# EAGLE design smarty04 (EAGLE 6.5.0)
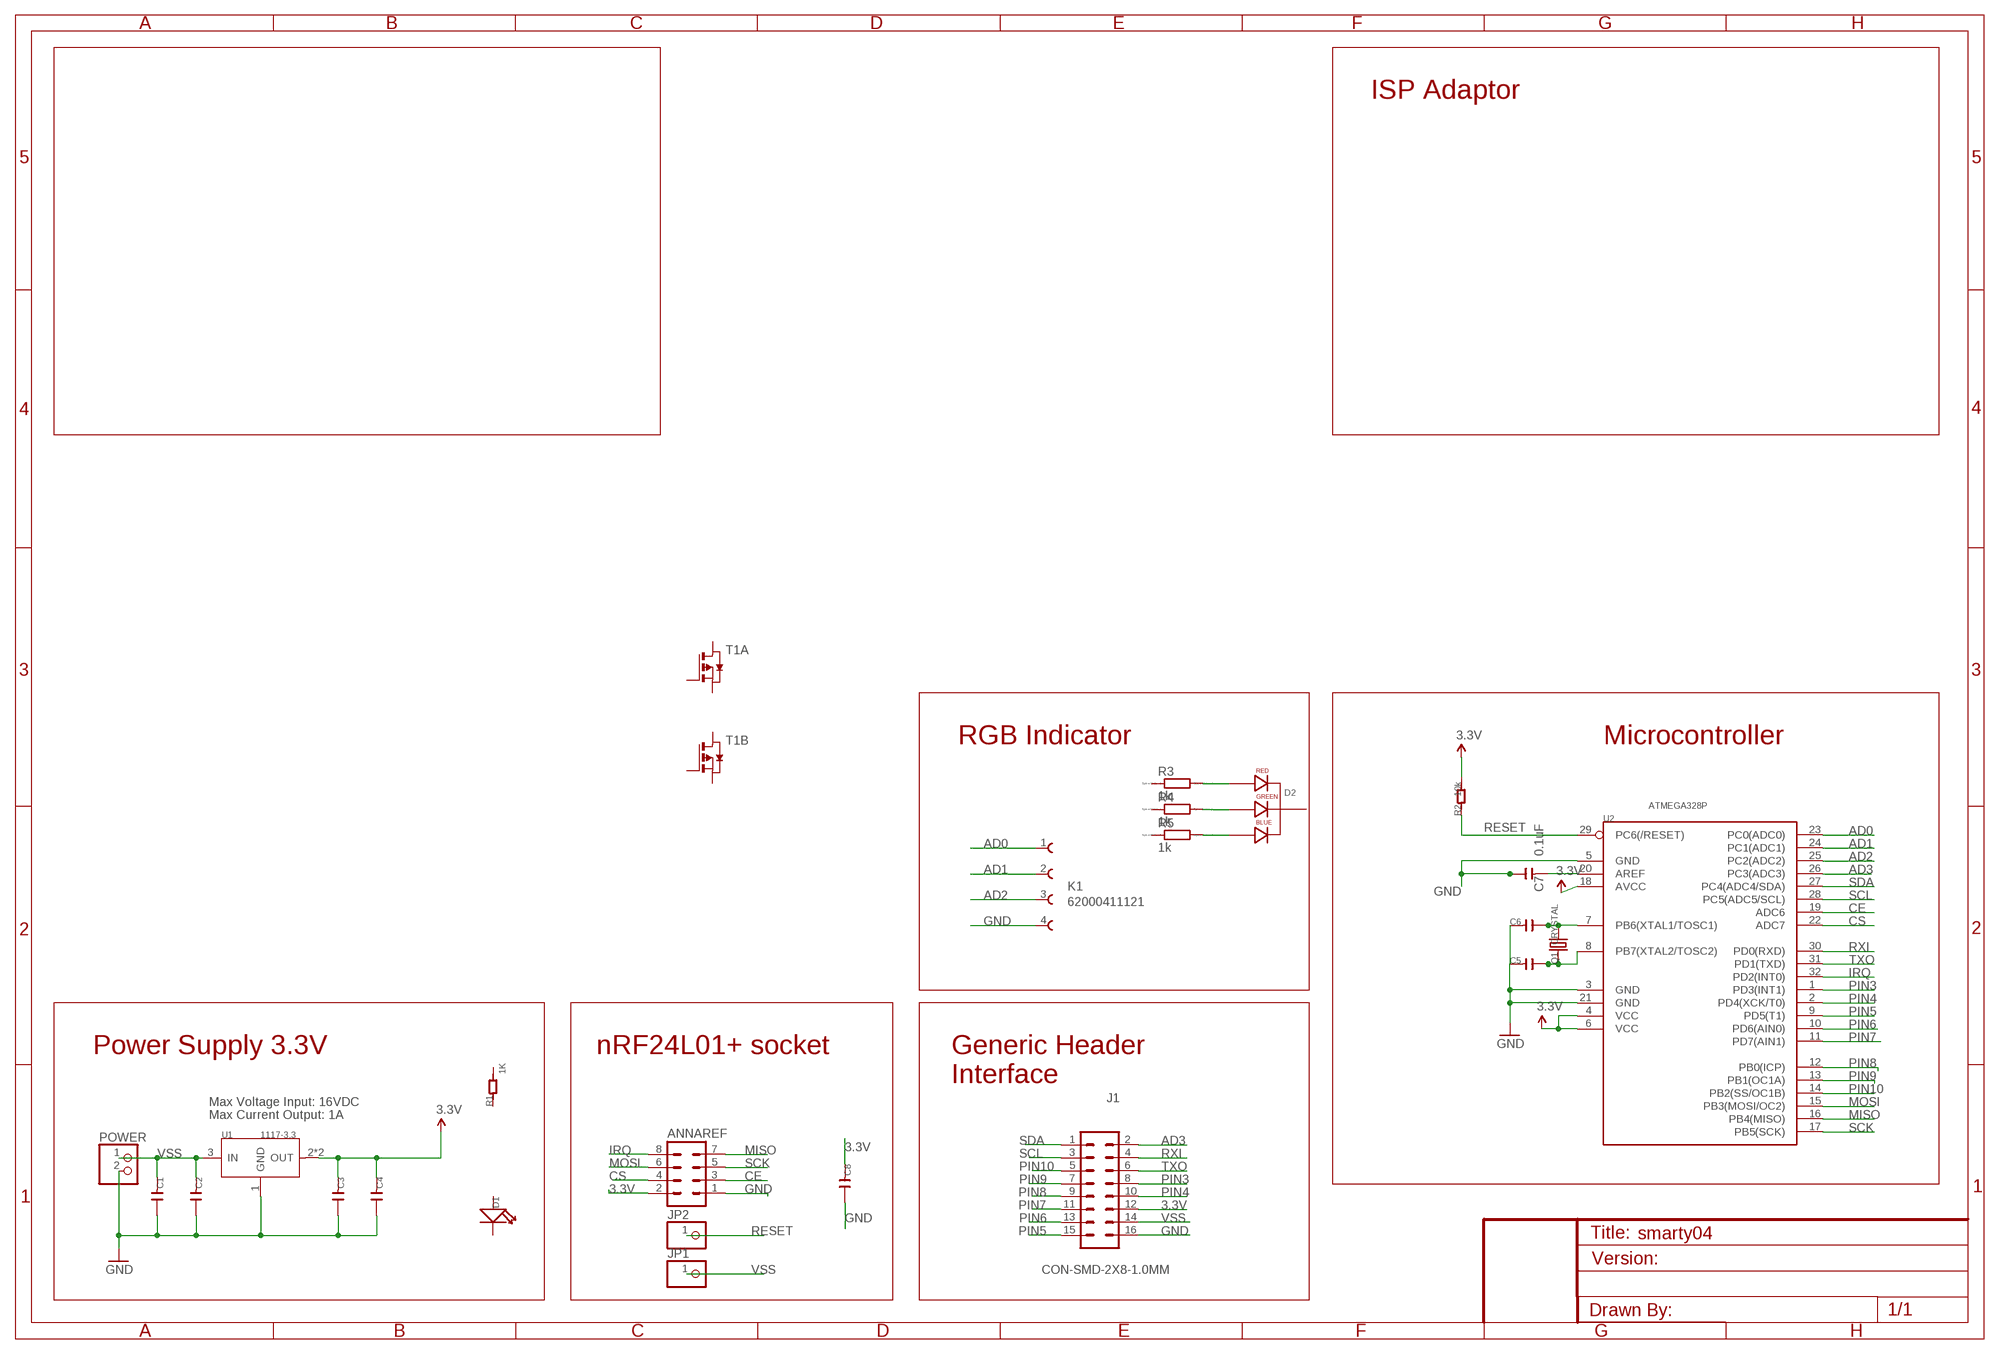
[diagram p0: schematic, sheet 1]

## Parts
ANNAREF  MA04-2  [MA04-2]
C1  C-0603  [C0603]
C2  C-0805  [C0805]
C3  C-0603  [C0603]
C4  C-0805  [C0805]
C5  C-0603  [C0603]
C6  C-0603  [C0603]
C7  0.1uF  C-0805  [C0805]
C8  C-0805  [C0805]
D1  LED  [LED0603]
D2  LED-RGB-CC-THRUCLEAR  [LED-RGB-THRU]
J1  CON-SMD-2X8-1.0MM  [SBH100-NBPC-D08]
JP1  PINHD-1X1  [1X01]
JP2  PINHD-1X1  [1X01]
K1  62000411121  [62000411121]
POWER  PINHD-1X2  [1X02]
Q1  CRYSTAL  CRYSTAL-0500290P1  [2P-SMD-5.0X3.2]
R1  1K  R-0603  [R0603]
R2  10k  R-0603  [R0603]
R3  1k  RR0603  [R0603]
R4  1k  RR0603  [R0603]
R5  1k  RR0603  [R0603]
T1  PMOS2SO8  [SO8]
U1  1117-3.3  CJ1117-3.3-1310120P1  [SOT89]
U2  ATMEGA328P  ATMEGA328P-AU-1030060P1  [TQFP32]

## Nets
3.3V [power]: ANNAREF.2 C3.1 C4.1 C8.1 J1.12 R2.2 U1.2(OUT) U1.4(OUT) U2.4(VCC) U2.6(VCC) U2.18(AVCC)
AD0: K1.1 U2.23(PC0(ADC0))
AD1: K1.2 U2.24(PC1(ADC1))
AD2: K1.3 U2.25(PC2(ADC2))
AD3: J1.2 U2.26(PC3(ADC3))
CE: ANNAREF.3 U2.19(ADC6)
CS: ANNAREF.4 U2.22(ADC7)
GND [power]: ANNAREF.1 C1.2 C2.2 C3.2 C4.2 C5.1 C6.1 C7.2 C8.2 J1.16 K1.4 POWER.2 U1.1(GND) U2.3(GND) U2.5(GND) U2.21(GND)
IRQ: ANNAREF.8 U2.32(PD2(INT0))
MISO: ANNAREF.7 U2.16(PB4(MISO))
MOSI: ANNAREF.6 U2.15(PB3(MOSI/OC2))
N$1: C7.1 U2.20(AREF)
N$2: C6.2 Q1.2 U2.7(PB6(XTAL1/TOSC1))
N$3: D2.1(RED_CATHODE) R3.2
N$4: C5.2 Q1.1 U2.8(PB7(XTAL2/TOSC2))
N$6: D2.3(GREEN_CATHODE) R4.2
N$7: D2.4(BLUE_CATHODE) R5.2
PIN3: J1.8 U2.1(PD3(INT1))
PIN4: J1.10 U2.2(PD4(XCK/T0))
PIN5: J1.15 U2.9(PD5(T1))
PIN6: J1.13 U2.10(PD6(AIN0))
PIN7: J1.11 U2.11(PD7(AIN1))
PIN8: J1.9 U2.12(PB0(ICP))
PIN9: J1.7 U2.13(PB1(OC1A))
PIN10: J1.5 U2.14(PB2(SS/OC1B))
RESET: JP2.1 R2.1 U2.29(PC6(/RESET))
RXI: J1.4 U2.30(PD0(RXD))
SCK: ANNAREF.5 U2.17(PB5(SCK))
SCL: J1.3 U2.28(PC5(ADC5/SCL))
SDA: J1.1 U2.27(PC4(ADC4/SDA))
TXO: J1.6 U2.31(PD1(TXD))
VSS [power]: C1.1 C2.1 J1.14 JP1.1 POWER.1 U1.3(IN)
Unconnected: D1.+ D1.- D2.2(CATHODE) R1.1 R1.2 R3.1 R4.1 R5.1 T1.1(A:S) T1.2(A:G) T1.3(B:S) T1.4(B:G) T1.5(B:D) T1.6(B:D) T1.7(A:D) T1.8(A:D)

## Notes on the sheet
- ISP Adaptor
- RGB Indicator | Microcontroller
- Power Supply 3.3V | nRF24L01+ socket
- Generic Header
  Interface
- Max Voltage Input: 16VDC
- Max Current Output: 1A

## Library data of the parts
ANNAREF = con-lstb:MA04-2: PIN HEADER; OC_FARNELL: unknown; OC_NEWARK: unknown
C1-C8 = OPL:C*
D1 = OPL:LED*: LED
D2 = SparkFun-LED:LED-RGB-CC-THRU: RGB Through-hole common cathode LED SparkFun Storefront: COM-00105 (Clear) COM-09264 (Diffuse); PROD_ID: DIO-08418
J1 = con-1.0mm:CON-SMD-2X8-1.0MM: HEADER - Vertical, Shrouded
JP1 JP2 = pinhead:PINHD-1X1: PIN HEADER
K1 = Wuerth_Elektronik_eiCan_01_Pin__Socked_Headers_v1_3:62000411121: WR-PHD 2.00mm Pin Header, 4 Pins
POWER = pinhead:PINHD-1X2: PIN HEADER
Q1 = OPL:CRYSTAL*
R1 R2 = OPL:R*
R3-R5 = eagle-ltspice:R: RESISTOR, European symbol; SPICEMODEL: NONE; SPICEPREFIX: R
T1 = zetex:PMOS2: DUAL 30V P-CHANNEL ENHANCEMENT MODE MOSFET Source: Data sheet <http://www.diodes.com/datasheets/ZXMP3A16DN8.pdf> SOP8 Source: Data sheet <http://www.diodes.com/datasheets/ZXMD63P03X.pdf> MSOP8; OC_FARNELL: unknown; OC_NEWARK: unknown
U1 = OPL:CJ1117-3.3: 1A Low Dropout Linear Regulator
U2 = OPL:ATMEGA328P-AU: 8-bit AVR Microcontroller with 32K Bytes In-System Programmable Flash

## Net classes
0 default: width 0.203 mm, drill 0.203 mm, clearance 0.305 mm
1 power: width 0.254 mm, drill 0.406 mm, clearance 0.305 mm

## Board
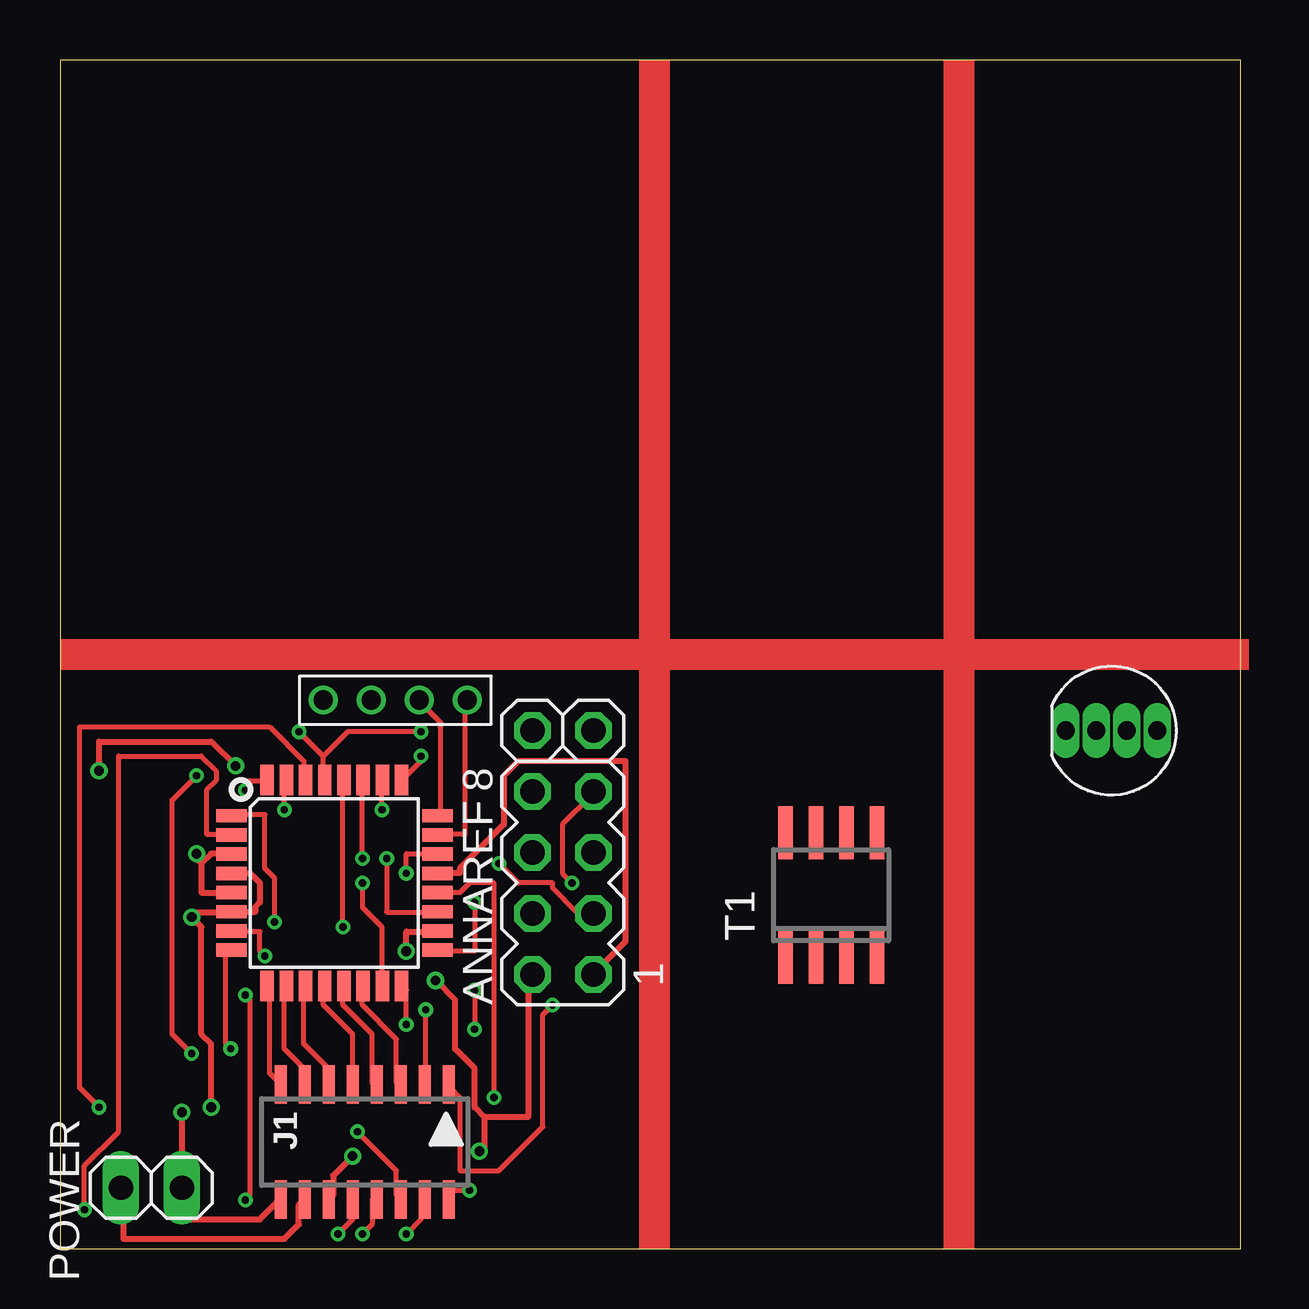
[diagram p1: board, top side]
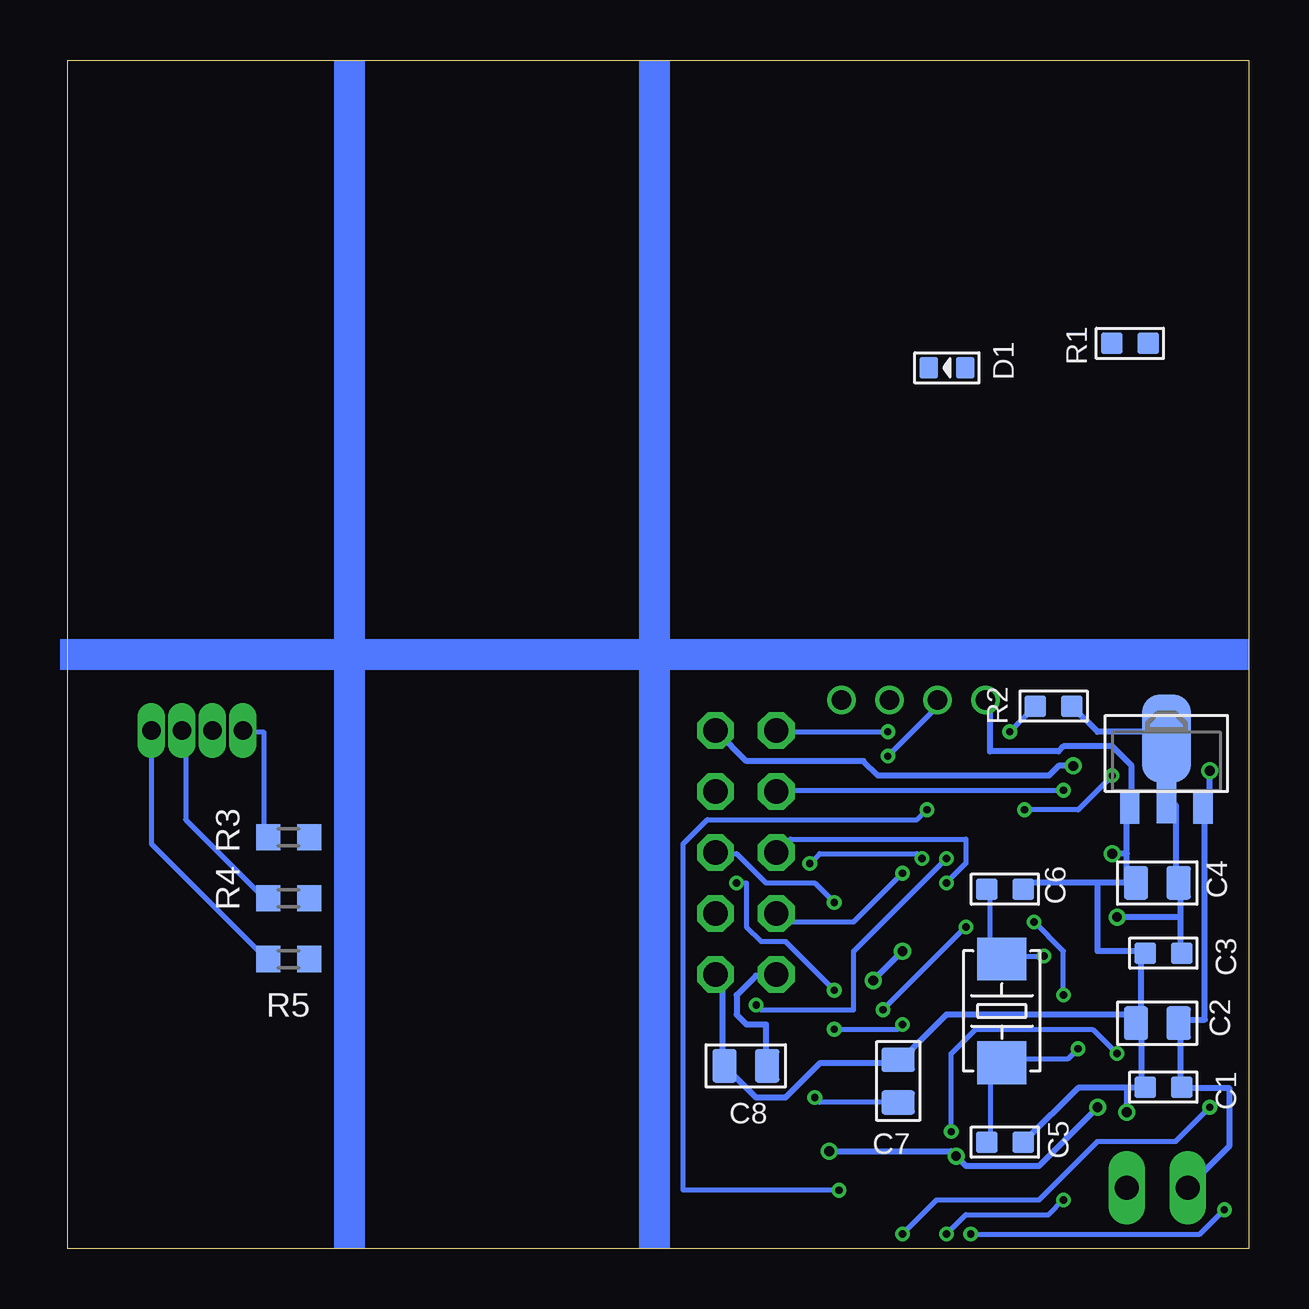
[diagram p2: board, bottom side, seen from below]

Size 49.2 x 49.52 mm. Coordinates in mm from the lower left corner, seen from the top.
Outline: 0,0 49.2,0 49.2,49.52 0,49.52 0,0
Copper layers (1*2*15*16): Top 0.035mm / dielectric 0.2mm / layer 2 0.0175mm / dielectric 1.1mm / layer 15 0.0175mm / dielectric 0.2mm / Bottom 0.035mm
Design rules "SeeedStudio_DRU_no_angle_20130527": minimum track width 6mil, minimum drill 12mil, track to track 6mil, track to pad 6mil, pad to pad 6mil, via to via 6mil, smd to smd 0mil, copper to edge 10mil, drill to drill 10mil, minimum pad ring 6mil, minimum via ring 6mil, stop-mask expansion 2mil, vias tented up to drill 25mil, thermal gap 10mil

### Footprints (pad centres in the part's own frame; a part is rotated, then mirrored left to right if it is on the bottom)
MA04-2 = drill 1.016 octagon: 1 -3.81,-1.27; 2 -3.81,1.27; 3 -1.27,-1.27; 4 -1.27,1.27; 5 1.27,-1.27; 6 1.27,1.27; 7 3.81,-1.27; 8 3.81,1.27
C0603 = smd 0.889 x 0.889: 1 -0.762,0; 2 0.762,0
C0805 = smd 1.016 x 1.397: 1 -0.889,0; 2 0.889,0
LED0603 = smd 0.762 x 0.889: + -0.762,0; - 0.762,0
LED-RGB-THRU = drill 0.762 pad 0.889 long: 1 1.905,0; 2 0.635,0; 3 -0.635,0; 4 -1.905,0
SBH100-NBPC-D08 = smd 0.5 x 1.6: 1 -3.5,-2.4; 2 -3.5,2.4; 3 -2.5,-2.4; 4 -2.5,2.4; 5 -1.5,-2.4; 6 -1.5,2.4; 7 -0.5,-2.4; 8 -0.5,2.4; 9 0.5,-2.4; 10 0.5,2.4; 11 1.5,-2.4; 12 1.5,2.4; 13 2.5,-2.4; 14 2.5,2.4; 15 3.5,-2.4; 16 3.5,2.4
1X01 = drill 1.016 octagon: 1 0,0
62000411121 = drill 0.8: 1 -3,0; 2 -1,0; 3 1,0; 4 3,0
1X02 = drill 1.016 long: 1 -1.27,0; 2 1.27,0
2P-SMD-5.0X3.2 = smd 1.778 x 2.032: 1 -2.159,0; 2 2.159,0
R0603 = smd 0.889 x 0.889: 1 -0.762,0; 2 0.762,0
R0603' = smd 1 x 1.1: 1 -0.85,0; 2 0.85,0
SO8 = smd 0.6 x 2.2: 1 -1.905,-2.6; 2 -0.635,-2.6; 3 0.635,-2.6; 4 1.905,-2.6; 5 1.905,2.6; 6 0.635,2.6; 7 -0.635,2.6; 8 -1.905,2.6
SOT89 = smd 0.8 x 1.4: 1 -1.524,-1.905; 3 1.524,-1.905 | smd 0.8 x 1.9: 2 0,-1.651 | smd 2.032 x 3.65: 4 0,0.94
TQFP32 = smd 1.27 x 0.559: 1 -4.293,2.8; 2 -4.293,2; 3 -4.293,1.2; 4 -4.293,0.4; 5 -4.293,-0.4; 6 -4.293,-1.2; 7 -4.293,-2; 8 -4.293,-2.8; 17 4.293,-2.8; 18 4.293,-2; 19 4.293,-1.2; 20 4.293,-0.4; 21 4.293,0.4; 22 4.293,1.2; 23 4.293,2; 24 4.293,2.8 | smd 0.559 x 1.27: 9 -2.8,-4.293; 10 -2,-4.293; 11 -1.2,-4.293; 12 -0.4,-4.293; 13 0.4,-4.293; 14 1.2,-4.293; 15 2,-4.293; 16 2.8,-4.293; 25 2.8,4.293; 26 2,4.293; 27 1.2,4.293; 28 0.4,4.293; 29 -0.4,4.293; 30 -1.2,4.293; 31 -2,4.293; 32 -2.8,4.293

### Placement (x,y rotation side)
ANNAREF  20.95,15.24 90 top
C1  3.56,6.73 180 bottom
C2  3.81,9.4 180 bottom
C3  3.56,12.32 180 bottom
C4  3.81,15.24 180 bottom
C5  10.16,4.45 180 bottom
C6  10.16,14.99 180 bottom
C7  14.61,6.99 90 bottom
C8  20.95,7.62 180 bottom
D1  12.57,36.7 180 bottom
D2  43.81,21.59 180 top
J1  12.7,4.45 180 top
JP1  22.23,21.59 0 top
JP2  19.68,21.59 0 top
K1  13.97,22.86 180 top
POWER  3.81,2.54 0 top
Q1  10.29,9.91 90 bottom
R1  4.95,37.72 0 bottom
R2  8.13,22.61 0 bottom
R3  1k  [R0603']  40.01,17.14 180 bottom
R4  1k  [R0603']  40.01,14.61 180 bottom
R5  1k  [R0603']  40.01,12.06 180 bottom
T1  32.13,14.73 0 top
U1  3.43,20.32 0 bottom
U2  11.43,15.24 0 top

### Tracks (layer width: path | path; a pad name or v marks a point on that pad's centre or on a via)
3.3V  (via drill 0.41)
  Top 0.254: U2.4 7.32,15.65 7.92,15.65 8.33,15.24 8.33,14.43 8.13,14.22 8.13,14.02 7.32,14.02 U2.6 7.11,14.02 5.49,14.02 v5.49,13.82 5.89,13.41 5.89,8.94 6.3,8.53 v6.3,5.89 | v14.43,12.39 14.43,13.21 15.65,13.21 U2.18 | v15.65,11.18 16.46,10.36 16.46,8.33 17.27,7.52 17.27,5.89 17.68,5.49 | 17.68,5.49 19.51,5.49 19.51,11.38 ANNAREF.2 | v12.19,3.86 11.38,3.05 11.38,2.23 J1.12 | v17.48,4.06 17.68,4.27 17.68,5.49
  Bottom 0.254: 2.85,13.82 2.85,15.24 C4.1 3.05,15.24 3.05,18.49 3.25,18.49 U1.2 3.45,18.69 3.45,21.13 U1.4 3.45,21.34 3.66,21.54 6.3,21.54 R2.2 | 2.85,13.82 2.85,12.39 C3.1 | 2.85,13.82 v5.49,13.82 | v15.65,11.18 v14.43,12.39 | C8.1 20.12,7.72 20.12,9.35 20.93,9.35 21.34,9.75 21.34,10.57 20.52,11.38 19.71,11.38 ANNAREF.2 | v17.48,4.06 12.39,4.06 v12.19,3.86 11.79,3.45 8.74,3.45 v6.3,5.89
AD0
  Top 0.203: U2.23 15.85,17.27 16.87,17.27 16.87,22.76 K1.1
AD1
  Top 0.203: U2.24 15.85,18.09 15.85,21.95 15.04,22.76 K1.2
AD2  (via drill 0.3)
  Top 0.203: v15.04,20.52 15.04,20.32 14.43,19.71 U2.25
  Bottom 0.203: v15.04,20.52 12.8,22.76 K1.3
AD3  (via drill 0.3)
  Top 0.203: v13.41,18.29 13.41,19.51 U2.26 | v17.07,2.44 16.26,2.44 16.26,2.23 J1.2
  Bottom 0.203: v13.41,18.29 13.82,17.88 22.55,17.88 23.57,16.87 23.57,2.44 v17.07,2.44
CE  (via drill 0.3)
  Top 0.203: v13.61,16.26 13.61,14.02 15.65,14.02 U2.19 | v18.29,16.05 19.1,15.24 20.52,15.24 20.52,15.04 21.54,14.02 22.15,14.02 ANNAREF.3
  Bottom 0.203: v13.61,16.26 13.82,16.46 17.88,16.46 v18.29,16.05
CS  (via drill 0.3)
  Top 0.203: v14.43,15.65 14.43,16.46 15.65,16.46 U2.22
  Bottom 0.203: v14.43,15.65 16.46,13.61 19.3,13.61 19.51,13.82 ANNAREF.4
GND  (via drill 0.41)
  Top 0.254: U2.21 15.85,15.65 16.66,15.65 16.66,15.85 18.49,17.68 18.49,19.71 19.1,20.32 23.57,20.32 23.57,12.8 22.35,11.58 ANNAREF.1 | 5.89,16.05 5.89,14.83 7.11,14.83 U2.5 | 5.89,16.05 6.3,16.46 7.11,16.46 U2.3 | 5.89,16.05 5.69,16.26 v5.69,16.46 | J1.16 9.14,2.03 8.33,1.22 5.08,1.22 POWER.2 v5.08,5.69
  Bottom 0.254: ANNAREF.1 22.15,11.38 21.95,11.38 21.95,7.72 C8.2 20.52,6.3 19.3,6.3 17.88,7.72 14.63,7.72 C7.2 14.43,7.92 12.6,9.75 4.47,9.75 | C6.1 9.14,15.24 6.3,15.24 | 5.08,15.24 6.3,15.24 | 5.08,15.24 5.08,16.46 | 5.08,16.46 5.08,18.29 U1.1 4.88,18.49 4.88,20.12 5.69,20.93 7.72,20.93 7.92,20.73 10.77,20.73 10.77,22.76 K1.4 | 5.08,15.24 C4.2 | 5.08,16.46 v5.69,16.46 | C2.2 4.67,9.35 4.47,9.35 4.47,6.91 C1.2 4.47,6.71 5.08,6.71 | 4.47,9.75 4.47,9.55 4.67,9.55 C2.2 | 4.47,9.75 4.47,12.19 C3.2 4.47,12.39 6.3,12.39 6.3,15.24 | 5.08,6.71 7.11,6.71 9.35,4.47 C5.1 | 4.47,9.75 C2.2 | 5.08,6.71 v5.08,5.69
IRQ  (via drill 0.3)
  Top 0.203: v7.72,19.1 7.92,19.3 7.92,19.51 8.53,19.51 U2.32
  Bottom 0.203: v7.72,19.1 19.51,19.1 ANNAREF.8
MISO  (via drill 0.3)
  Top 0.203: v14.43,9.35 14.43,10.77 U2.16 | v17.27,10.77 v17.27,9.14 | v21.34,15.24 20.93,15.65 20.93,17.68 22.15,18.9 ANNAREF.7
  Bottom 0.203: v14.43,9.35 14.63,9.14 v17.27,9.14 | v17.27,10.77 19.3,12.8 20.32,12.8 20.93,13.41 20.93,15.24 v21.34,15.24
MOSI  (via drill 0.3)
  Top 0.203: v12.6,15.24 12.6,14.22 13.41,13.41 13.41,10.97 U2.15
  Bottom 0.203: v12.6,15.24 11.79,16.05 11.79,17.07 19.1,17.07 19.51,16.66 ANNAREF.6
N$1  (via drill 0.3)
  Top 0.203: v18.09,6.3 18.09,15.24 17.07,15.24 16.66,14.83 15.85,14.83 U2.20
  Bottom 0.203: v18.09,6.3 17.88,6.1 C7.1
N$2  (via drill 0.3)
  Top 0.203: v8.53,12.19 8.33,12.39 8.33,13.21 7.32,13.21 U2.7
  Bottom 0.203: 10.97,15.04 C6.2 10.77,14.83 10.77,12.19 10.36,12.19 Q1.2 10.16,12.19 v8.53,12.19
N$3
  Bottom 0.203: R3.2 41.05,17.27 41.05,21.54 41.86,21.54 D2.1
N$4  (via drill 0.3)
  Top 0.203: v7.11,8.33 6.91,8.53 6.91,12.19 7.11,12.39 U2.8
  Bottom 0.203: 10.97,4.47 C5.2 10.77,4.47 10.77,7.72 10.36,7.72 Q1.1 10.16,7.92 7.52,7.92 v7.11,8.33
N$6
  Bottom 0.203: R4.2 41.05,14.63 44.3,17.88 44.3,21.54 D2.3
N$7
  Bottom 0.203: D2.4 45.72,16.87 41.05,12.19 R5.2
PIN3  (via drill 0.3)
  Top 0.203: v8.94,13.61 8.94,15.44 8.53,15.85 8.53,18.09 7.32,18.09 U2.1 | v7.72,10.57 7.92,10.36 7.92,2.23 v7.72,2.03 | v12.6,0.61 13.01,1.02 13.01,2.03 J1.8
  Bottom 0.203: v8.94,13.61 7.72,12.39 v7.72,10.57 | v7.72,2.03 8.33,1.42 11.79,1.42 v12.6,0.61
PIN4  (via drill 0.3)
  Top 0.203: v1.02,1.63 1.02,3.45 2.44,4.88 2.44,20.52 5.89,20.52 6.5,19.91 6.5,19.51 6.1,19.1 6.1,17.27 7.11,17.27 U2.2 | v11.58,0.61 12.19,1.22 12.19,2.03 J1.10
  Bottom 0.203: v1.02,1.63 2.03,0.61 v11.58,0.61
PIN5
  Top 0.203: U2.9 8.74,10.77 8.74,7.32 9.14,6.91 J1.15
PIN6
  Top 0.203: U2.10 9.35,10.77 9.35,8.33 10.16,7.52 10.16,6.91 J1.13
PIN7
  Top 0.203: U2.11 10.16,10.77 10.16,8.53 11.18,7.52 11.18,6.91 J1.11
PIN8
  Top 0.203: U2.12 10.97,10.77 10.97,10.16 12.19,8.94 12.19,6.91 J1.9
PIN9
  Top 0.203: U2.13 11.79,10.77 11.79,10.16 13.01,8.94 13.01,6.91 J1.7
PIN10
  Top 0.203: U2.14 12.6,10.77 12.6,10.16 14.02,8.74 14.02,6.91 J1.5
RESET  (via drill 0.3)
  Top 0.203: 10.97,20.52 v9.96,21.54 | 10.97,20.52 10.97,19.71 U2.29 | 10.97,20.52 11.99,21.54 v15.04,21.54
  Bottom 0.203: v9.96,21.54 R2.1 | v15.04,21.54 19.51,21.54 JP2.1
RXI  (via drill 0.3)
  Top 0.203: v1.63,5.89 0.81,6.71 0.81,21.74 8.74,21.74 10.16,20.32 10.16,19.71 U2.30 | v14.43,0.61 15.04,1.22 15.04,2.03 J1.4
  Bottom 0.203: v1.63,5.89 3.05,4.47 6.3,4.47 8.74,2.03 13.01,2.03 v14.43,0.61
SCK  (via drill 0.3)
  Top 0.203: v17.27,14.43 17.27,12.39 15.85,12.39 U2.17
  Bottom 0.203: v17.27,14.43 18.09,15.24 20.12,15.24 21.34,16.46 22.15,16.46 ANNAREF.5
SCL  (via drill 0.3)
  Top 0.203: v11.79,13.41 11.79,19.51 U2.28 | v15.24,9.96 15.24,6.91 J1.3
  Bottom 0.203: v15.24,9.96 v11.79,13.41
SDA  (via drill 0.3)
  Top 0.203: v12.6,16.26 12.6,19.51 U2.27 | v20.52,10.16 20.12,9.75 20.12,5.08 18.29,3.25 16.66,3.25 16.66,6.3 16.26,6.71 J1.1
  Bottom 0.203: v12.6,16.26 16.46,12.39 16.46,9.96 20.32,9.96 v20.52,10.16
TXO  (via drill 0.3)
  Top 0.203: v9.35,18.29 9.35,19.51 U2.31 | v5.69,19.71 4.67,18.69 4.67,8.94 v5.49,8.13 | v12.39,4.88 14.02,3.25 14.02,2.23 J1.6
  Bottom 0.203: v9.35,18.29 7.11,18.29 v5.69,19.71 | v5.49,8.13 6.5,9.14 11.38,9.14 12.39,8.13 v12.39,4.88
VSS  (via drill 0.41)
  Top 0.254: J1.14 10.16,2.03 9.96,1.83 9.96,1.02 9.35,0.41 2.64,0.41 2.64,2.44 POWER.1 | v7.32,20.12 6.3,21.13 1.63,21.13 v1.63,19.91
  Bottom 0.254: v7.32,20.12 7.92,20.12 8.33,19.71 15.44,19.71 16.05,20.32 20.93,20.32 22.15,21.54 JP1.1 | v1.63,19.91 1.63,18.49 1.83,18.49 U1.3 1.83,18.29 1.83,9.55 2.85,9.55 C2.1 2.85,9.35 2.85,6.91 C1.1 2.64,6.71 0.81,6.71 0.81,4.27 POWER.1
(copper drawn outside any net)
  shapes: Bottom area x3, Top area x3

### Text on the board
tDocu: - | + | -
bDocu: RoboTal / Generic / Smartie | v1.0